# Altium schematic sheet SIM800L.SchDoc
size A4; SheetNumber: 2; SheetTotal: 7
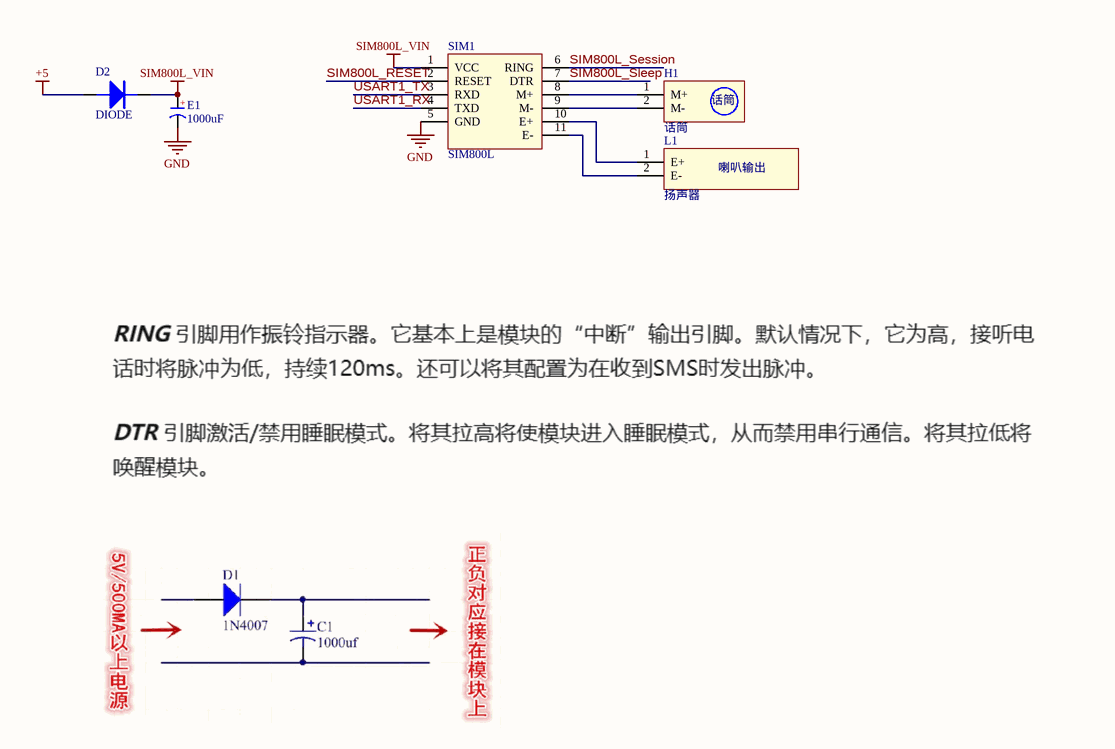
[diagram p0: SIM800L.SchDoc]

## Parts
D2  DIODE  [DO-15]
E1  1000uF  [CAP 1.5*4*8]
H1  话筒  [话筒]
L1  扬声器  [扬声器]
SIM1  SIM800L  [SIM800L]

## Nets
+5: D2.A
GND: E1.2(K) SIM1.5(GND)
SIM800L_VIN: D2.K E1.1(A) SIM1.1(VCC)
SIM800L_RESET: SIM1.2(RESET)
SIM800L_Session: SIM1.6(RING)
SIM800L_Sleep: SIM1.7(DTR)
USART1_RX: SIM1.4(TXD)
USART1_TX: SIM1.3(RXD)
NetH1_1: H1.1(M+) SIM1.8(M+)
NetH1_2: H1.2(M-) SIM1.9(M-)
NetL1_1: L1.1(E+) SIM1.10(E+)
NetL1_2: L1.2(E-) SIM1.11(E-)

## Notes on the sheet
- (in symbol C-CAP) +
- (in symbol 扬声器) 喇叭输出

## Library data of the parts
D2 = DIODE: 普通二极管
E1 = C-CAP: 直插电解电容; 版权归属: 源创客; BOM名称: 直插电解电容; 学习资源: www.ooocke.com